# Altium schematic sheet vram.SchDoc: SoPC Oscilloscope - VRAM, Display
size A; DrawnBy: Santiago Navonne; Revision: 1.1; SheetNumber: 4; SheetTotal: 5
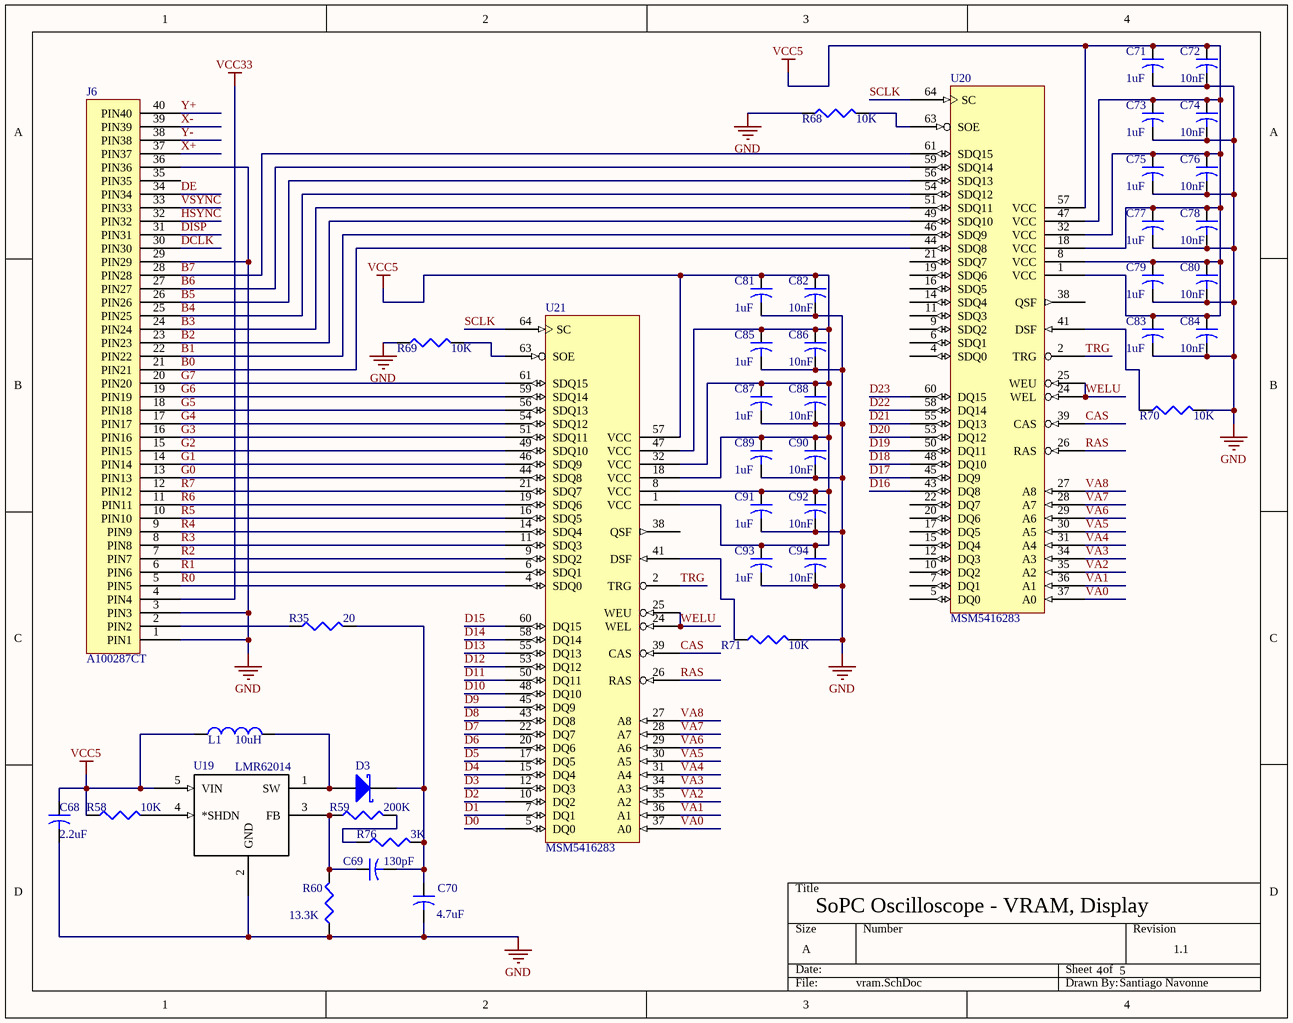
[diagram p0: vram.SchDoc]

## Parts
C68  value 2.2uF  [CAPC1608L]  (hidden comment: Cap2)
C69  value 130pF  [CAPC2012N]  (hidden comment: Cap2)
C70  value 4.7uF  [CAPC1608L]  (hidden comment: Cap2)
C71  value 1uF  [CAPC1608L]  (hidden comment: Cap2)
C72  value 10nF  [CAPC1608L]  (hidden comment: Cap2)
C73  value 1uF  [CAPC1608L]  (hidden comment: Cap2)
C74  value 10nF  [CAPC1608L]  (hidden comment: Cap2)
C75  value 1uF  [CAPC1608L]  (hidden comment: Cap2)
C76  value 10nF  [CAPC1608L]  (hidden comment: Cap2)
C77  value 1uF  [CAPC1608L]  (hidden comment: Cap2)
C78  value 10nF  [CAPC1608L]  (hidden comment: Cap2)
C79  value 1uF  [CAPC1608L]  (hidden comment: Cap2)
C80  value 10nF  [CAPC1608L]  (hidden comment: Cap2)
C81  value 1uF  [CAPC1608L]  (hidden comment: Cap2)
C82  value 10nF  [CAPC1608L]  (hidden comment: Cap2)
C83  value 1uF  [CAPC1608L]  (hidden comment: Cap2)
C84  value 10nF  [CAPC1608L]  (hidden comment: Cap2)
C85  value 1uF  [CAPC1608L]  (hidden comment: Cap2)
C86  value 10nF  [CAPC1608L]  (hidden comment: Cap2)
C87  value 1uF  [CAPC1608L]  (hidden comment: Cap2)
C88  value 10nF  [CAPC1608L]  (hidden comment: Cap2)
C89  value 1uF  [CAPC1608L]  (hidden comment: Cap2)
C90  value 10nF  [CAPC1608L]  (hidden comment: Cap2)
C91  value 1uF  [CAPC1608L]  (hidden comment: Cap2)
C92  value 10nF  [CAPC1608L]  (hidden comment: Cap2)
C93  value 1uF  [CAPC1608L]  (hidden comment: Cap2)
C94  value 10nF  [CAPC1608L]  (hidden comment: Cap2)
D3  D Schottky  [PowerDI123]  (value not drawn)
J6  A100287CT  [FPC40]
L1  value 10uH  [lsdr0703]  (hidden comment: Inductor)
R35  value 20  [RESC1608N]  (hidden comment: Res3)
R58  value 10K  [RESC1608N]  (hidden comment: Res3)
R59  value 200K  [RESC1608N]  (hidden comment: Res3)
R60  value 13.3K  [RESC1608N]  (hidden comment: Res3)
R68  value 10K  [RESC1608N]  (hidden comment: Res3)
R69  value 10K  [RESC1608N]  (hidden comment: Res3)
R70  value 10K  [RESC1608N]  (hidden comment: Res3)
R71  value 10K  [RESC1608N]  (hidden comment: Res3)
R76  value 3K  [RESC1608N]  (hidden comment: Res3)
U19  LMR62014  [MF05A]
U20  MSM5416283  [SSOP64]
U21  MSM5416283  [SSOP64]

## Nets
GND: C68.2 C70.2 C71.2 C72.2 C73.2 C74.2 C75.2 C76.2 C77.2 C78.2 C79.2 C80.2 C81.2 C82.2 C83.2 C84.2 C85.2 C86.2 C87.2 C88.2 C89.2 C90.2 C91.2 C92.2 C93.2 C94.2 J6.1(PIN1) J6.3(PIN3) J6.29(PIN29) J6.36(PIN36) R60.1 R68.1 R69.1 R70.2 R71.2 U19.2(GND) U20.3(GND) U20.13(GND) U20.23(GND) U20.33(GND) U20.42(GND) U20.52(GND) U20.62(GND) U21.3(GND) U21.13(GND) U21.23(GND) U21.33(GND) U21.42(GND) U21.52(GND) U21.62(GND)
VCC5: C68.1 C71.1 C72.1 C73.1 C74.1 C75.1 C76.1 C77.1 C78.1 C79.1 C80.1 C81.1 C82.1 C83.1 C84.1 C85.1 C86.1 C87.1 C88.1 C89.1 C90.1 C91.1 C92.1 C93.1 C94.1 L1.1 R58.1 U19.5(VIN) U20.1(VCC) U20.8(VCC) U20.18(VCC) U20.32(VCC) U20.47(VCC) U20.57(VCC) U21.1(VCC) U21.8(VCC) U21.18(VCC) U21.32(VCC) U21.47(VCC) U21.57(VCC)
VCC33: J6.4(PIN4)
B0: J6.21(PIN21) U20.44(SDQ8)
B1: J6.22(PIN22) U20.46(SDQ9)
B2: J6.23(PIN23) U20.49(SDQ10)
B3: J6.24(PIN24) U20.51(SDQ11)
B4: J6.25(PIN25) U20.54(SDQ12)
B5: J6.26(PIN26) U20.56(SDQ13)
B6: J6.27(PIN27) U20.59(SDQ14)
B7: J6.28(PIN28) U20.61(SDQ15)
CAS: U20.39(CAS) U21.39(CAS)
D0: U21.5(DQ0)
D1: U21.7(DQ1)
D2: U21.10(DQ2)
D3: U21.12(DQ3)
D4: U21.15(DQ4)
D5: U21.17(DQ5)
D6: U21.20(DQ6)
D7: U21.22(DQ7)
D8: U21.43(DQ8)
D9: U21.45(DQ9)
D10: U21.48(DQ10)
D11: U21.50(DQ11)
D12: U21.53(DQ12)
D13: U21.55(DQ13)
D14: U21.58(DQ14)
D15: U21.60(DQ15)
D16: U20.43(DQ8)
D17: U20.45(DQ9)
D18: U20.48(DQ10)
D19: U20.50(DQ11)
D20: U20.53(DQ12)
D21: U20.55(DQ13)
D22: U20.58(DQ14)
D23: U20.60(DQ15)
DCLK: J6.30(PIN30)
DE: J6.34(PIN34)
DISP: J6.31(PIN31)
G0: J6.13(PIN13) U21.44(SDQ8)
G1: J6.14(PIN14) U21.46(SDQ9)
G2: J6.15(PIN15) U21.49(SDQ10)
G3: J6.16(PIN16) U21.51(SDQ11)
G4: J6.17(PIN17) U21.54(SDQ12)
G5: J6.18(PIN18) U21.56(SDQ13)
G6: J6.19(PIN19) U21.59(SDQ14)
G7: J6.20(PIN20) U21.61(SDQ15)
HSYNC: J6.32(PIN32)
R0: J6.5(PIN5) U21.4(SDQ0)
R1: J6.6(PIN6) U21.6(SDQ1)
R2: J6.7(PIN7) U21.9(SDQ2)
R3: J6.8(PIN8) U21.11(SDQ3)
R4: J6.9(PIN9) U21.14(SDQ4)
R5: J6.10(PIN10) U21.16(SDQ5)
R6: J6.11(PIN11) U21.19(SDQ6)
R7: J6.12(PIN12) U21.21(SDQ7)
RAS: U20.26(RAS) U21.26(RAS)
SCLK: U20.64(SC) U21.64(SC)
TRG: U20.2(TRG) U21.2(TRG)
VA0: U20.37(A0) U21.37(A0)
VA1: U20.36(A1) U21.36(A1)
VA2: U20.35(A2) U21.35(A2)
VA3: U20.34(A3) U21.34(A3)
VA4: U20.31(A4) U21.31(A4)
VA5: U20.30(A5) U21.30(A5)
VA6: U20.29(A6) U21.29(A6)
VA7: U20.28(A7) U21.28(A7)
VA8: U20.27(A8) U21.27(A8)
VSYNC: J6.33(PIN33)
WELU: U20.24(WEL) U20.25(WEU) U21.24(WEL) U21.25(WEU)
X+: J6.37(PIN37)
X-: J6.39(PIN39)
Y+: J6.40(PIN40)
Y-: J6.38(PIN38)
NetC69_1: C69.1 R59.1 R60.2 U19.3(FB)
NetC69_2: C69.2 C70.1 D3.K R35.2 R76.2
NetD3_A: D3.A L1.2 U19.1(SW)
NetJ6_2: J6.2(PIN2) R35.1
NetR58_2: R58.2 U19.4(*SHDN)
NetR59_2: R59.2 R76.1
NetR68_2: R68.2 U20.63(SOE)
NetR69_2: R69.2 U21.63(SOE)
NetR70_1: R70.1 U20.41(DSF)
NetR71_1: R71.1 U21.41(DSF)

Not connected (* = marked no-connect by the designer): J6 35(PIN35); U20 4(SDQ0) 5(DQ0) 6(SDQ1) 7(DQ1) 9(SDQ2) 10(DQ2) 11(SDQ3) 12(DQ3) 14(SDQ4) 15(DQ4) 16(SDQ5) 17(DQ5) 19(SDQ6) 20(DQ6) 21(SDQ7) 22(DQ7) 38(QSF); U21 38(QSF)

## Library data of the parts
C68-C94 = Cap2: Capacitor; Published: 23-Sep-2002; PackageReference: CAPR5-4X5; Publisher: Altium Limited; PackageDescription: Capacitor; 2 Leads
D3 = D Schottky: Schottky Diode; Published: 8-Jun-2000; LatestRevisionDate: 17-Jul-2002; LatestRevisionNote: Re-released for DXP Platform.; PackageReference: SMB; Publisher: Altium Limited; PackageDescription: DO-214-AA/SMB; 2 C-Bend Leads; Body 5.3 x 3.6 mm, inc. leads (LxW); Code_JEDEC: DO-214-AA
L1 = Inductor: Code_IEC: 1005; Published: 8-Jun-2000; LatestRevisionDate: 29-May-2009; LatestRevisionNote: IPC-7351 Footprint Added.; PackageReference: 0402-A; Publisher: Altium Limited; PackageDescription: Chip Inductor; Code_JEITA: 0402
R35 R58-R60 R68-R71 R76 = Res3: Resistor; Published: 8-Jun-2000; LatestRevisionDate: 29-May-2009; LatestRevisionNote: IPC-7351 Footprint Added.; PackageReference: J1-0603; Publisher: Altium Limited; PackageDescription: Chip Resistor
U19 = LMR62014_DBV_5: Imported; Manufacturer: Texas Instruments; DatasheetURL: http://www.ti.com/lit/ds/symlink/lmr62014.pdf; basePN: LMR62014; NSC_PackageReference: MF05A; Manufacturer_Part_Number: lmr62014_dbv_5; Vendor: Texas Instruments; RefDes: RefDes; Type: DEV; Value: Value
U20 U21 = MSM5416283: 262,144-Word x 16-Bit Multiport DRAM